# EAGLE design ADC_PRUEBA_V2 (EAGLE 9.5.2)
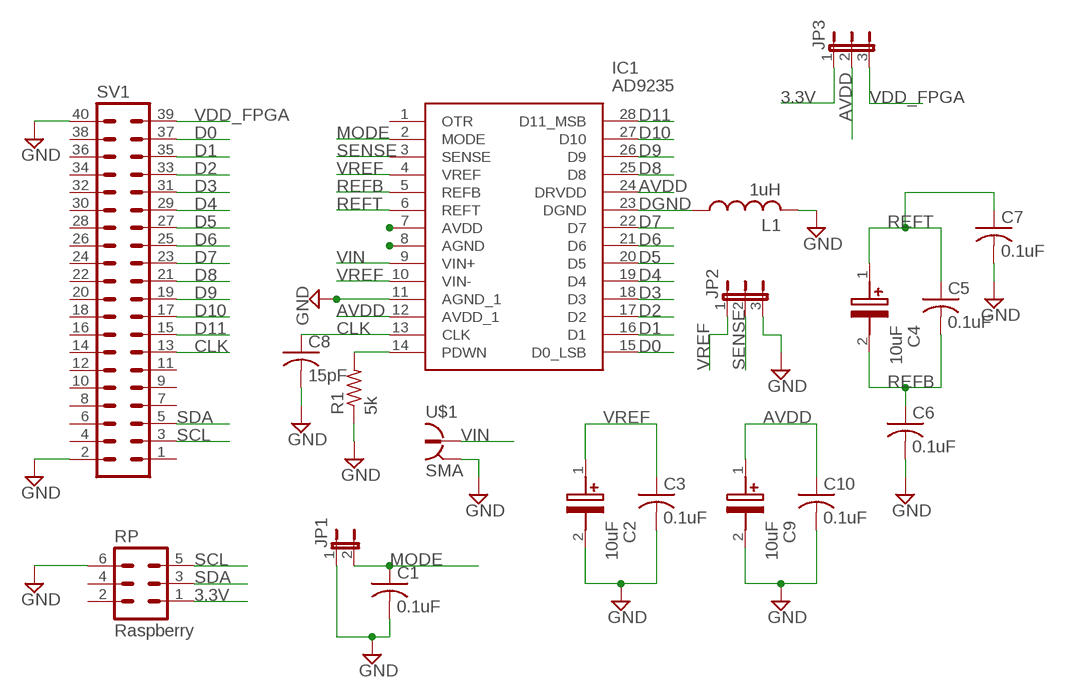
[diagram p0: schematic, sheet 1]

## Parts
C1  0.1uF  C-USC0805K  [C0805K]
C2  10uF  TAJC106K035RNJV  [CAPPM6032X280N]
C3  0.1uF  C-USC0805K  [C0805K]
C4  10uF  TAJC106K035RNJV  [CAPPM6032X280N]
C5  0.1uF  C-USC0805K  [C0805K]
C6  0.1uF  C-USC0805K  [C0805K]
C7  0.1uF  C-USC0805K  [C0805K]
C8  15pF  C-USC0805K  [C0805K]
C9  10uF  TAJC106K035RNJV  [CAPPM6032X280N]
C10  0.1uF  C-USC0805K  [C0805K]
IC1  AD9235  AD9235BRUZ-65  [SOP65P638X110-28N]
JP1  JP1E  [JP1]
JP2  JP2E  [JP2]
JP3  JP2E  [JP2]
L1  1uH  L-USL2012C  [L2012C]
R1  5k  R-US_R0805  [R0805]
RP  Raspberry  MA03-2  [MA03-2]
SV1  MA20-2  [MA20-2]
U$1  SMA  [SMA]

## Nets
3.3V: JP3.1 RP.1
AVDD: C9.1(+) C10.1 IC1.12(AVDD_1) IC1.24(DRVDD) JP3.2
CLK: C8.1 IC1.13(CLK) SV1.13
D0: IC1.15(D0_LSB) SV1.37
D1: IC1.16(D1) SV1.35
D2: IC1.17(D2) SV1.33
D3: IC1.18(D3) SV1.31
D4: IC1.19(D4) SV1.29
D5: IC1.20(D5) SV1.27
D6: IC1.21(D6) SV1.25
D7: IC1.22(D7) SV1.23
D8: IC1.25(D8) SV1.21
D9: IC1.26(D9) SV1.19
D10: IC1.27(D10) SV1.17
D11: IC1.28(D11_MSB) SV1.15
DGND: IC1.23(DGND) L1.1
GND: C1.2 C2.2(-) C3.2 C6.2 C7.2 C8.2 C9.2(-) C10.2 IC1.11(AGND_1) JP1.1 JP2.3 L1.2 R1.1 RP.6 SV1.2 SV1.40 U$1.GND U$1.P$2(GND) U$1.P$3(GND) U$1.P$4(GND)
MODE: C1.1 IC1.2(MODE) JP1.2
N$1: IC1.7(AVDD)
N$2: IC1.8(AGND)
N$13: IC1.14(PDWN) R1.2
REFB: C4.2(-) C5.2 C6.1 IC1.5(REFB)
REFT: C4.1(+) C5.1 C7.1 IC1.6(REFT)
SCL: RP.5 SV1.3
SDA: RP.3 SV1.5
SENSE: IC1.3(SENSE) JP2.2
VDD_FPGA: JP3.3 SV1.39
VIN: IC1.9(VIN+) U$1.IN
VREF: C2.1(+) C3.1 IC1.4(VREF) IC1.10(VIN-) JP2.1
Unconnected: IC1.1(OTR) RP.2 RP.4 SV1.1 SV1.4 SV1.6 SV1.7 SV1.8 SV1.9 SV1.10 SV1.11 SV1.12 SV1.14 SV1.16 SV1.18 SV1.20 SV1.22 SV1.24 SV1.26 SV1.28 SV1.30 SV1.32 SV1.34 SV1.36 SV1.38

## Library data of the parts
C1 C3 C5-C8 C10 = rcl:C-US: CAPACITOR, American symbol; SPICEPREFIX: C
C2 C4 C9 = TAN_Capacitor_2312_10UF:TAJC106K035RNJV: Tantalum Capacitors - Solid SMD 35V 10uF 10% 2312 ESR = 1 Ohms Source: Datasheet <https://componentsearchengine.com/Datasheets/1/TAJC106K035RNJV.pdf>; DESCRIPTION: Tantalum Capacitors - Solid SMD 35V 10uF 10% 2312 ESR = 1 Ohms; HEIGHT: 2.8mm; MANUFACTURER_NAME: AVX; MANUFACTURER_PART_NUMBER: TAJC106K035RNJV; MOUSER_PART_NUMBER: 581-TAJC106K035RNJV; MOUSER_PRICE-STOCK: https://www.mouser.com/Search/Refine.aspx?Keyword=581-TAJC106K035RNJV
IC1 = AD9235BRUZ-65:AD9235BRUZ-65: AD9235BRUZ-65, 12 bit ADC Differential,, Parallel, 28-Pin TSSOP Source: Datasheet <https://componentsearchengine.com/Datasheets/1/AD9235BRUZ-65.pdf>; DESCRIPTION: AD9235BRUZ-65, 12 bit ADC Differential,, Parallel, 28-Pin TSSOP; HEIGHT: 1.1mm; MANUFACTURER_NAME: Analog Devices; MANUFACTURER_PART_NUMBER: AD9235BRUZ-65; MOUSER_PART_NUMBER: 584-AD9235BRUZ-65; MOUSER_PRICE-STOCK: https://www.mouser.com/Search/Refine.aspx?Keyword=584-AD9235BRUZ-65
JP1 = jumper:JP1E: JUMPER
JP2 JP3 = jumper:JP2E: JUMPER
L1 = rcl:L-US: INDUCTOR, American symbol; SPICEPREFIX: L
R1 = rcl:R-US_: RESISTOR, American symbol; SPICEPREFIX: R
RP = con-lstb:MA03-2: PIN HEADER; OC_FARNELL: unknown; OC_NEWARK: unknown
SV1 = con-lstb:MA20-2: PIN HEADER; OC_FARNELL: unknown; OC_NEWARK: unknown
U$1 = SMA:SMA

## Board
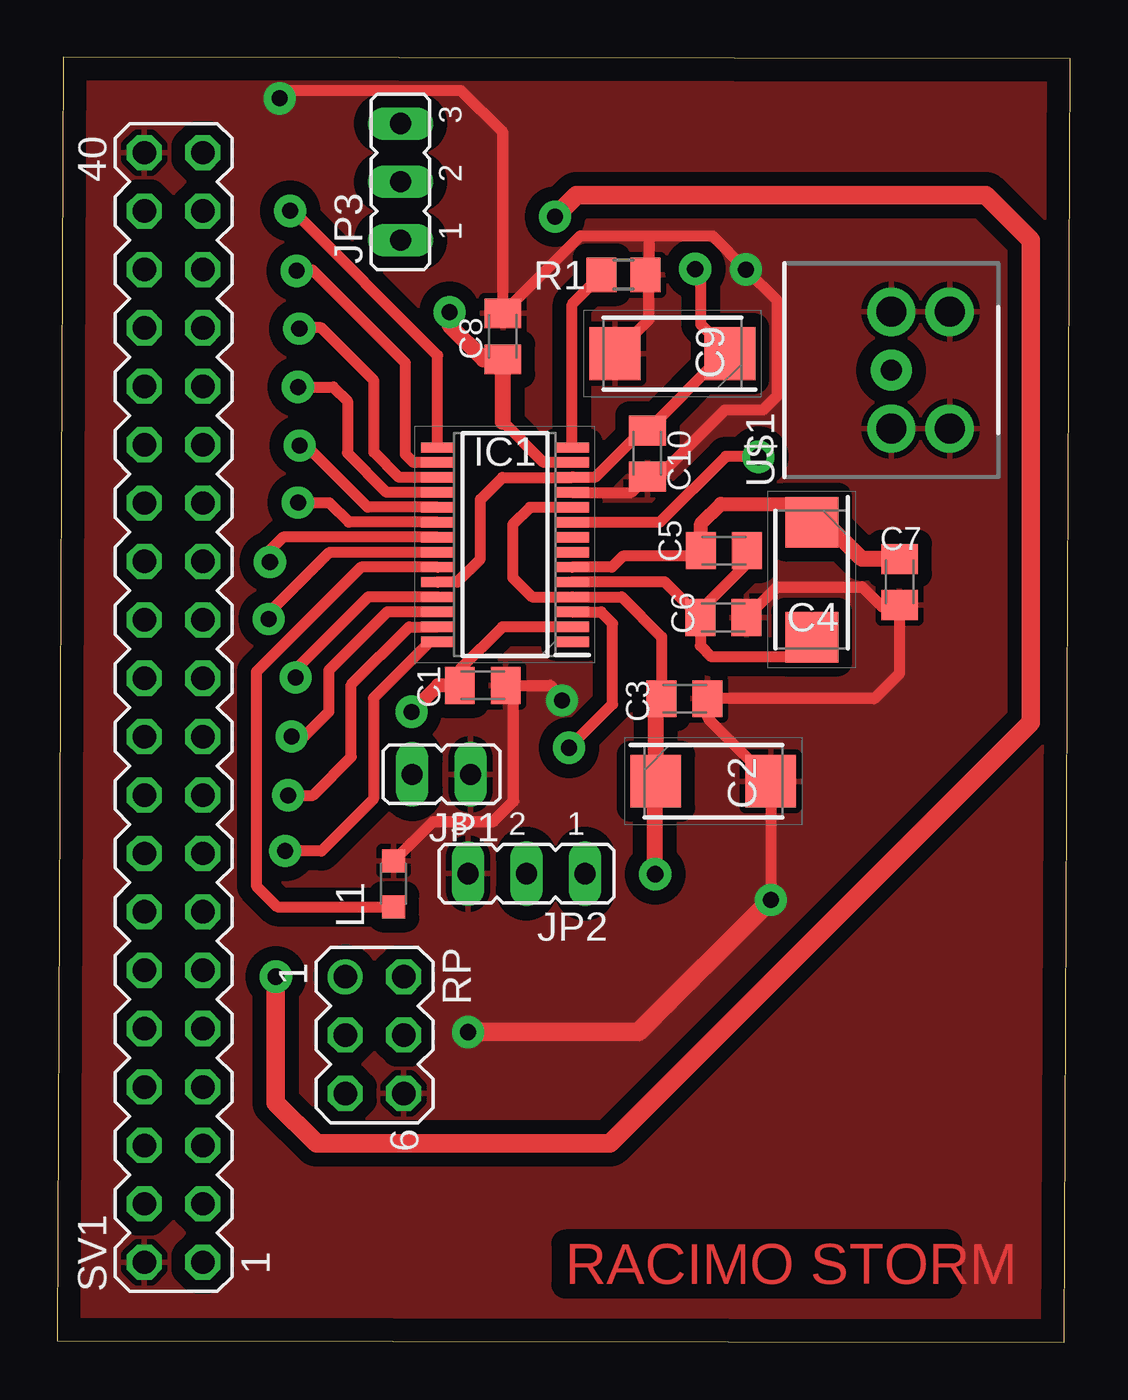
[diagram p1: board, top side]
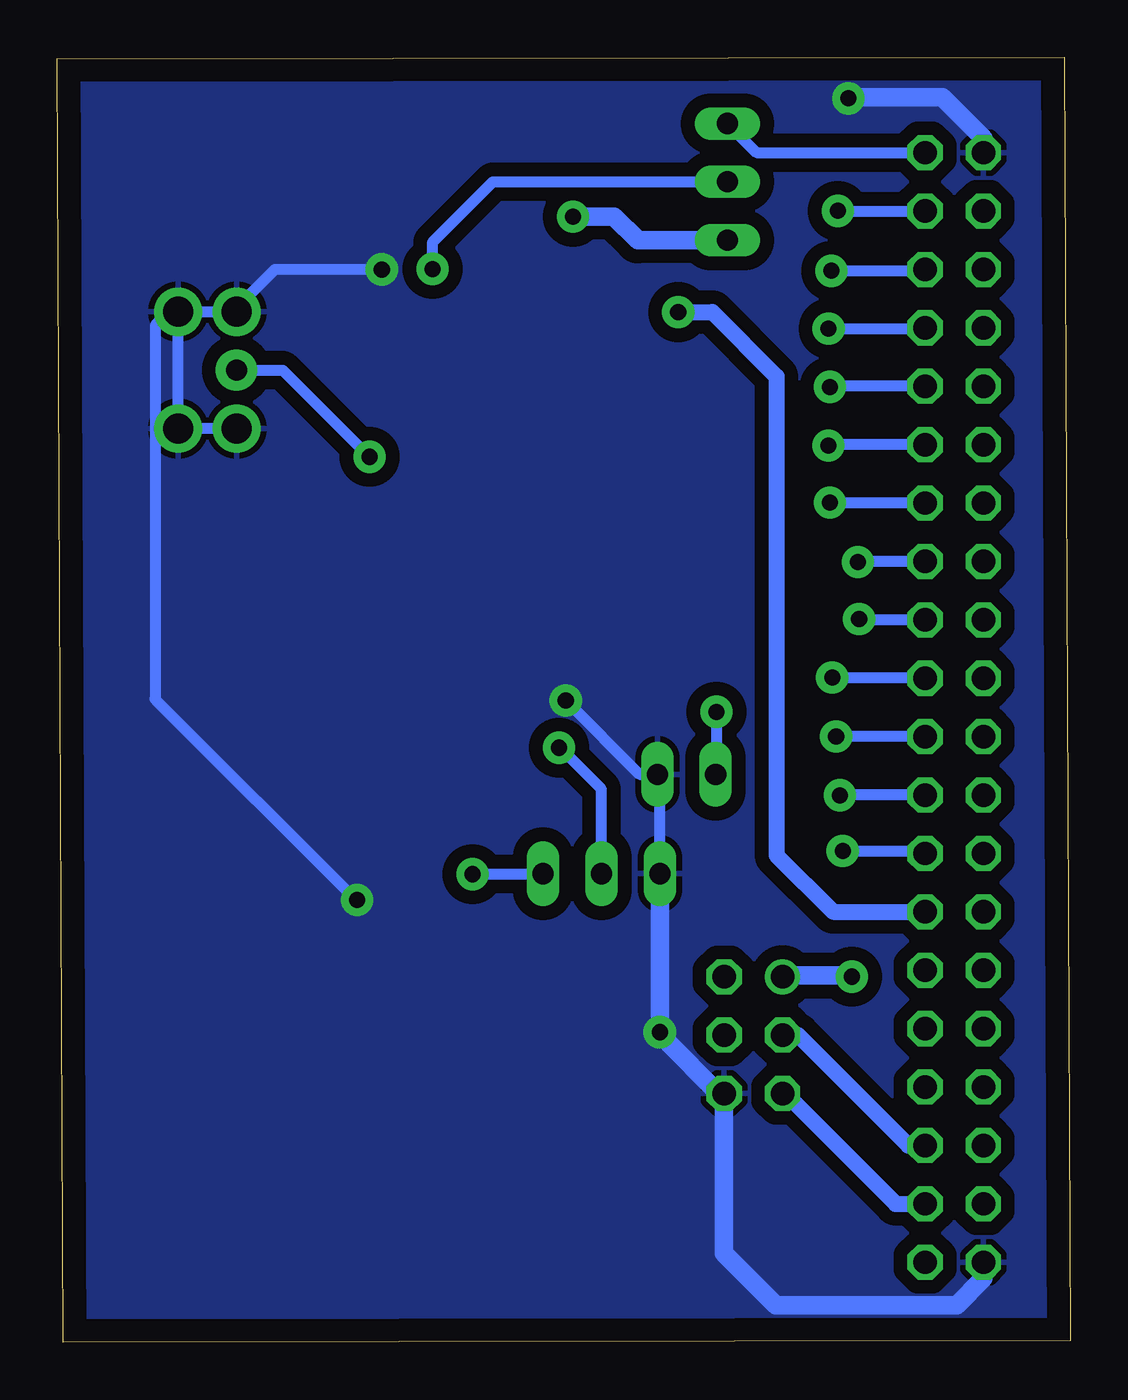
[diagram p2: board, bottom side, seen from below]

Size 44.06 x 55.87 mm. Coordinates in mm from the lower left corner, seen from the top.
Outline: 0,0.05 43.8,0 44.06,55.82 0.26,55.87 0,0.05
Copper layers (1*16): Top 0.035mm / dielectric 1.5mm / Bottom 0.035mm
Design rules "default": minimum track width 6mil, minimum drill 0.35mm, track to track 6mil, track to pad 6mil, pad to pad 6mil, via to via 6mil, smd to smd 6mil, copper to edge 40mil, drill to drill 6mil, minimum pad ring 10mil, minimum via ring 8mil, stop-mask expansion 4mil, vias tented up to drill 0mil, thermal gap 10mil

### Footprints (pad centres in the part's own frame; a part is rotated, then mirrored left to right if it is on the bottom)
C0805K = smd 1.3 x 1.6: 1 -1,0; 2 1,0
CAPPM6032X280N = smd 2.2 x 2.3: 1 -2.5,0; 2 2.5,0
SOP65P638X110-28N = smd 1.45 x 0.45: 1 -2.925,4.225; 2 -2.925,3.575; 3 -2.925,2.925; 4 -2.925,2.275; 5 -2.925,1.625; 6 -2.925,0.975; 7 -2.925,0.325; 8 -2.925,-0.325; 9 -2.925,-0.975; 10 -2.925,-1.625; 11 -2.925,-2.275; 12 -2.925,-2.925; 13 -2.925,-3.575; 14 -2.925,-4.225; 15 2.925,-4.225; 16 2.925,-3.575; 17 2.925,-2.925; 18 2.925,-2.275; 19 2.925,-1.625; 20 2.925,-0.975; 21 2.925,-0.325; 22 2.925,0.325; 23 2.925,0.975; 24 2.925,1.625; 25 2.925,2.275; 26 2.925,2.925; 27 2.925,3.575; 28 2.925,4.225
JP1 = drill 0.914 long: 1 0,-1.27; 2 0,1.27
JP2 = drill 0.914 long: 1 -2.54,0; 2 0,0; 3 2.54,0
L2012C = smd 1 x 1: 1 -1,0; 2 1,0
R0805 = smd 1.3 x 1.5: 1 -0.95,0; 2 0.95,0
MA03-2 = drill 1.016: 1 -2.54,-1.27 | drill 1.016 octagon: 2 -2.54,1.27; 3 0,-1.27; 4 0,1.27; 5 2.54,-1.27; 6 2.54,1.27
MA20-2 = drill 1.016 octagon: 1 -24.13,-1.27; 2 -24.13,1.27; 3 -21.59,-1.27; 4 -21.59,1.27; 5 -19.05,-1.27; 6 -19.05,1.27; 7 -16.51,-1.27; 8 -16.51,1.27; 9 -13.97,-1.27; 10 -13.97,1.27; 11 -11.43,-1.27; 12 -11.43,1.27; 13 -8.89,-1.27; 14 -8.89,1.27; 15 -6.35,-1.27; 16 -6.35,1.27; 17 -3.81,-1.27; 18 -3.81,1.27; 19 -1.27,-1.27; 20 -1.27,1.27; 21 1.27,-1.27; 22 1.27,1.27; 23 3.81,-1.27; 24 3.81,1.27; 25 6.35,-1.27; 26 6.35,1.27; 27 8.89,-1.27; 28 8.89,1.27; 29 11.43,-1.27; 30 11.43,1.27; 31 13.97,-1.27; 32 13.97,1.27; 33 16.51,-1.27; 34 16.51,1.27; 35 19.05,-1.27; 36 19.05,1.27; 37 21.59,-1.27; 38 21.59,1.27; 39 24.13,-1.27; 40 24.13,1.27
SMA = drill 1.3 pad 2.1: GND 2.54,0; P$2 -2.54,0; P$3 2.54,-2.54; P$4 -2.54,-2.54 | drill 0.9 pad 1.8: IN 0,0

### Placement (x,y rotation side)
C1  18.5,28.56 0 top
C2  28.53,24.39 0 top
C3  27.28,27.98 0 top
C4  32.81,33.16 270 top
C5  28.99,34.42 0 top
C6  28.96,31.51 0 top
C7  36.63,33.06 270 top
C8  19.37,43.74 90 top
C9  26.75,42.99 180 top
C10  25.66,38.65 270 top
IC1  19.46,34.68 180 top
JP1  16.7,24.69 90 top
JP2  20.4,20.37 180 top
JP3  14.92,50.46 90 top
L1  14.62,19.93 90 top
R1  24.62,46.42 180 top
RP  13.79,13.35 270 top
SV1  5.05,27.6 90 top
U$1  36.27,42.27 90 top

### Tracks (layer width: path | path; a pad name or v marks a point on that pad's centre or on a via)
3.3V  (via drill 0.7 pad 1.4)
  Top 0.8: v9.5,15.89 9.5,10.41 11.27,8.64 24.03,8.64 42.34,26.95 42.34,47.93 40.39,49.88 22.57,49.88 v21.64,48.95
  Bottom 0.48: RP.1 12.46,15.95 | 9.72,15.95 9.58,15.81 v9.5,15.89
  Bottom 0.8: 12.46,15.95 9.72,15.95 | JP3.1 18.82,47.92 19.85,48.95 v21.64,48.95
AVDD  (via drill 0.7 pad 1.4)
  Top 0.48: IC1.24 17.39,33.05 18.4,34.06 18.4,36.65 19.36,37.6 IC1.12 22.4,37.62 23.41,37.62 25.44,39.65 C10.1 29,42.99 C9.1 27.98,44.26 27.98,46.43 v27.74,46.67
  Bottom 0.48: v27.74,46.67 27.74,47.84 25.12,50.46 JP3.2
CLK  (via drill 0.7 pad 1.4)
  Top 0.48: IC1.13 21.15,38.25 19.37,40.03 | C8.1 18.53,42.74
  Top 0.7: 19.37,40.03 C8.1 | v17.06,44.8 17.06,44.21 18.53,42.74
  Bottom 0.7: v17.06,44.8 15.58,44.8 12.78,42 12.78,21.17 10.32,18.71 SV1.13
D0  (via drill 0.7 pad 1.4)
  Top 0.48: IC1.15 16.54,42.91 10.2,49.24 10.16,49.24 v10.12,49.2
  Bottom 0.48: v10.12,49.2 v10.11,49.19 SV1.37
D1  (via drill 0.7 pad 1.4)
  Top 0.48: IC1.16 15.48,38.25 15.14,38.6 15.14,42.58 11.09,46.63 10.4,46.63 v10.4,46.59
  Bottom 0.48: v10.4,46.59 6.38,46.59 SV1.35
D2  (via drill 0.7 pad 1.4)
  Top 0.48: IC1.17 14.87,37.6 13.77,38.7 13.77,41.81 11.47,44.11 10.52,44.11 v10.52,44.07
  Bottom 0.48: v10.52,44.07 6.36,44.07 SV1.33
D3  (via drill 0.7 pad 1.4)
  Top 0.48: IC1.18 14.32,36.95 12.61,38.67 12.61,40.93 12,41.54 v10.46,41.54
  Bottom 0.48: SV1.31 10.41,41.57 10.42,41.58 v10.46,41.54
D4  (via drill 0.7 pad 1.4)
  Top 0.48: IC1.19 13.49,36.3 10.81,38.99 v10.53,38.99
  Bottom 0.48: SV1.29 10.43,39.03 10.47,38.99 v10.53,38.99
D5  (via drill 0.7 pad 1.4)
  Top 0.48: IC1.20 12.67,35.66 11.82,36.51 v10.46,36.51
  Bottom 0.48: SV1.27 10.37,36.49 10.39,36.51 v10.46,36.51
D6  (via drill 0.7 pad 1.4)
  Top 0.48: IC1.21 9.8,35 9.24,34.44 v9.24,33.93
  Bottom 0.48: SV1.25 9.18,33.95 9.2,33.97 v9.24,33.93
D7  (via drill 0.7 pad 1.4)
  Top 0.48: v9.19,31.45 9.19,31.7 11.84,34.35 IC1.22
  Bottom 0.48: SV1.23 9.19,31.41 v9.19,31.45
D8  (via drill 0.7 pad 1.4)
  Top 0.48: IC1.25 13.51,32.41 10.36,29.25 v10.36,28.9
  Bottom 0.48: v10.36,28.9 6.35,28.9 SV1.21
D9  (via drill 0.7 pad 1.4)
  Top 0.48: IC1.26 14.34,31.75 11.8,29.21 11.8,27.41 10.73,26.34 v10.19,26.34
  Bottom 0.48: SV1.19 10.13,26.33 10.14,26.34 v10.19,26.34
D10  (via drill 0.7 pad 1.4)
  Top 0.48: v10.03,23.78 11.11,23.78 12.78,25.45 12.78,28.59 15.29,31.1 IC1.27
  Bottom 0.48: SV1.17 9.99,23.79 10,23.78 v10.03,23.78
D11  (via drill 0.7 pad 1.4)
  Top 0.48: IC1.28 16.19,30.45 13.74,28.01 13.74,23.61 11.48,21.35 v9.9,21.35
  Bottom 0.48: v9.9,21.35 6.42,21.35 SV1.15
DGND
  Top 0.48: IC1.23 13.21,33.7 8.65,29.15 8.65,19.84 9.56,18.93 L1.1
GND  (via drill 0.7 pad 1.4)
  Top 0.48: IC1.11 24.96,36.95 C10.2 26.15,37.65 29.05,40.55 30.7,40.55 31.31,41.16 31.31,45.29 v29.95,46.65 28.49,48.11 25.73,48.11 | 25.24,46.42 R1.1 25.73,46.58 | C1.2 19.84,28.56 | 19.84,28.56 21.44,28.56 21.95,28.05 v21.95,27.9 | C6.2 31.29,32.84 35.01,32.84 35.9,31.95 36.52,31.95 C7.2 36.63,29.08 35.53,27.98 28.3,27.98 | 28.3,27.98 C3.2 | 28.3,27.98 28.3,27.12 C2.2 v31.03,19.23 | 14.48,20.79 L1.2 16.33,22.64 18.95,22.64 19.84,23.53 19.84,28.56 | v9.66,54.09 10.01,54.44 17.54,54.44 19.37,52.61 C8.2 22.74,48.11 25.73,48.11 | 25.73,48.11 25.73,46.58 | C9.2 25.73,44.47 25.73,46.58
  Top 0.8: v31.03,19.23 25.28,13.48 v17.86,13.48
  Bottom 0.48: JP2.3 17.86,24.58 JP1.1 18.74,24.69 v21.95,27.9 | 30.16,46.69 30.15,46.7 30,46.7 v29.95,46.65 34.61,46.65 36.45,44.81 | 15.06,10.58 RP.6 | v17.86,13.48 17.86,13.38 | 39.82,27.97 39.78,27.93 | 39.78,27.93 31.05,19.2 v31.03,19.22 v31.03,19.23 | 39.78,27.93 39.78,44.26 39.23,44.81 38.75,44.81 | 38.75,44.81 36.45,44.81 | 36.45,44.81 U$1.GND | U$1.P$2 U$1.P$4 38.81,44.75 38.75,44.81
  Bottom 0.8: SV1.2 3.78,2.77 4.95,1.6 12.8,1.6 15.06,3.86 15.06,10.58 17.86,13.38 | JP2.3 v17.86,13.48 | 9.59,54.14 5.57,54.15 3.78,52.36 SV1.40
  pour Top (isolate 0.61): 0.27,55.81 43.99,55.81 44.08,55.72 44.08,0.1 43.98,0 0.07,0 0.06,0.01 0.06,55.51 0.3,55.75
  pour Bottom (isolate 0.6): 0.34,55.81 43.98,55.81 44,55.79 44,0.04 0.15,0.04 0.12,0.07 0.12,55.62 0.31,55.81
MODE  (via drill 0.7 pad 1.4)
  Top 0.48: IC1.2 19.36,31.1 17.5,29.25 C1.1
  Top 0.6: C1.1 16.55,28.56 v15.4,27.41
  Bottom 0.48: v15.4,27.41 15.4,24.72 JP1.2
N$13
  Top 0.48: IC1.14 22.39,45.13 R1.2
REFB
  Top 0.48: IC1.5 26.42,33.05 C6.1 | C5.2 29.99,33.87 27.96,31.83 C6.1 | C6.1 27.96,30.29 28.45,29.8 32.3,29.8 32.81,30.31 C4.2
REFT
  Top 0.48: IC1.6 24.12,33.7 24.59,34.18 27.75,34.18 C5.1 | 33.4,36.45 33.15,36.45 33.15,35.9
  Top 0.6: C5.1 27.99,35.59 28.85,36.45 33.15,36.45
  Top 0.7: C7.1 34.99,34.06 33.58,35.47 33.39,35.66 | 33.39,35.66 33.15,35.9 | C4.1 33.39,35.66
SCL
  Bottom 0.48: RP.5 12.4,10.81
  Bottom 0.7: 12.4,10.81 7.6,6.01 SV1.3
SDA
  Bottom 0.7: SV1.5 7.05,8.55 11.85,13.35 RP.3
SENSE  (via drill 0.7 pad 1.4)
  Top 0.48: IC1.3 23.65,31.75 24.15,31.25 24.15,27.75 v22.25,25.85
  Bottom 0.48: JP2.2 20.4,24.05 22.2,25.85 v22.25,25.85
VDD_FPGA
  Bottom 0.48: JP3.3 13.65,51.73 SV1.39
VIN  (via drill 0.7 pad 1.4)
  Top 0.48: IC1.9 26.21,35.66 29.07,38.52 30.47,38.52 v30.49,38.5
  Bottom 0.48: v30.49,38.5 34.26,42.27 U$1.IN
VREF  (via drill 0.7 pad 1.4)
  Top 0.48: IC1.10 20.55,36.3 19.8,35.55 19.8,33.25 20.65,32.41 IC1.4 24.55,32.41 26.28,30.67 C3.1 26.01,27.71 | v26.01,20.36 v26,20.35
  Top 0.7: v26,20.35 26,24.36 C2.1 | C3.1 26.03,27.73 C2.1 | C2.1 26.28,24.64
  Bottom 0.48: v26,20.35 22.96,20.35 JP2.1

### Text on the board
Top: RACIMO STORM